# Altium schematic sheet IMU_Sensor.SchDoc
size A4; Author: İlker KESER; Revision: V1.0; SheetNumber: 9; SheetTotal: 9; Page: 9; Page Total: 9; Template: A4; Project Code: 02050838
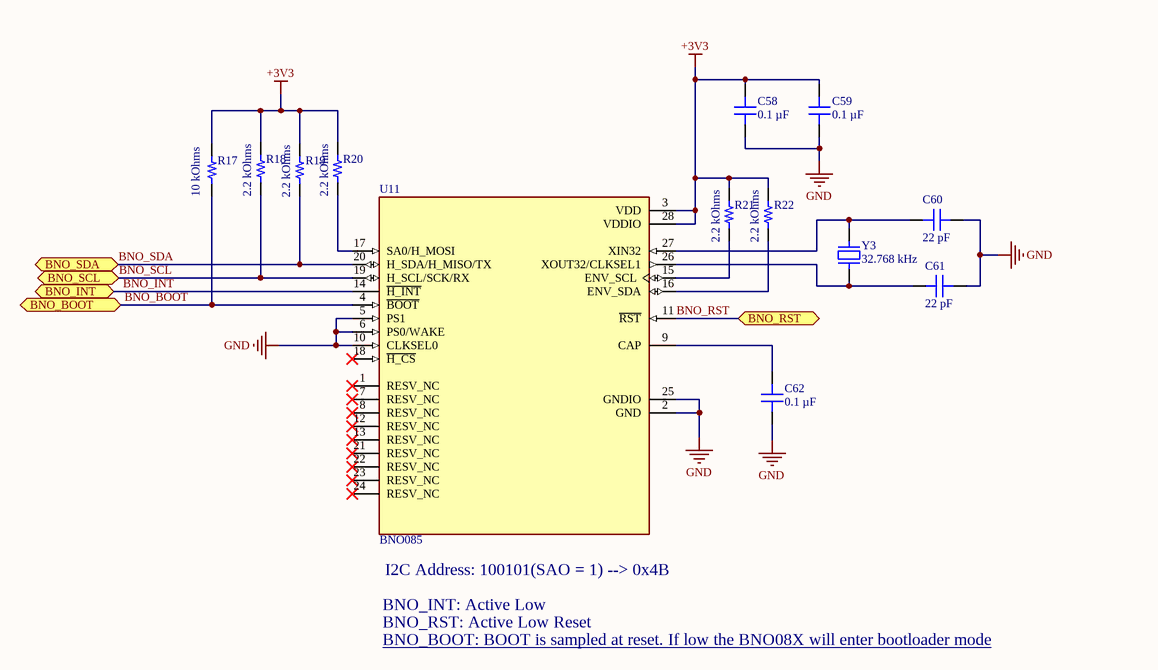
[diagram p0: IMU_Sensor.SchDoc]

## Parts
C58  0.1 µF  [CAP 0402_1005]
C59  0.1 µF  [CAP 0402_1005]
C60  22 pF  [CAP 0603_1608]
C61  22 pF  [CAP 0603_1608]
C62  0.1 µF  [CAP 0402_1005]
R17  10 kOhms  [RES 0402_1005]
R18  2.2 kOhms  [YAGEO RES 0402_1005]
R19  2.2 kOhms  [YAGEO RES 0402_1005]
R20  2.2 kOhms  [YAGEO RES 0402_1005]
R21  2.2 kOhms  [YAGEO RES 0402_1005]
R22  2.2 kOhms  [YAGEO RES 0402_1005]
U11  BNO085  [BNO085]
Y3  32.768 kHz  [ABRACON ABS06]

## Ports
BNO_BOOT (bidir, see Microcontroller[2A]), BNO_INT (bidir, see Microcontroller[2A]), BNO_RST (bidir, see Microcontroller[2A]), BNO_SCL (bidir, see Microcontroller[2A]), BNO_SDA (bidir, see Microcontroller[2B])

## Nets
+3V3: C58.2 C59.2 R17.2 R18.2 R19.2 R20.2 R21.2 R22.2 U11.3(VDD) U11.28(VDDIO)
GND: C58.1 C59.1 C60.2 C61.2 C62.1 U11.2(GND) U11.5(PS1) U11.6(PS0/WAKE) U11.10(CLKSEL0) U11.25(GNDIO)
BNO_BOOT: R17.1 U11.4(~{BOOT}) ; port BNO_BOOT
BNO_INT: U11.14(~{H_INT}) ; port BNO_INT
BNO_RST: U11.11(~{RST}) ; port BNO_RST
BNO_SCL: R18.1 U11.19(H_SCL/SCK/RX) ; port BNO_SCL
BNO_SDA: R19.1 U11.20(H_SDA/H_MISO/TX) ; port BNO_SDA
NetC60_1: C60.1 U11.27(XIN32) Y3.2
NetC61_1: C61.1 U11.26(XOUT32/CLKSEL1) Y3.1
NetC62_2: C62.2 U11.9(CAP)
NetR20_1: R20.1 U11.17(SA0/H_MOSI)
NetR21_1: R21.1 U11.15(ENV_SCL)
NetR22_1: R22.1 U11.16(ENV_SDA)

Not connected (* = marked no-connect by the designer): U11 1(RESV_NC)* 7(RESV_NC)* 8(RESV_NC)* 12(RESV_NC)* 13(RESV_NC)* 18(~{H_CS})* 21(RESV_NC)* 22(RESV_NC)* 23(RESV_NC)* 24(RESV_NC)*

## Notes on the sheet
- I2C Address: 100101(SAO = 1) --> 0x4B
- BNO_INT: Active Low
- BNO_RST: Active Low Reset
- BNO_BOOT: BOOT is sampled at reset. If low the BNO08X will enter bootloader mode <https://www.mouser.com.tr/datasheet/2/1480/BNO080_085_Datasheet-3196201.pdf>
- TITLE:
- DOCUMENT NAME:
- PROJECT CODE:
- TEMPLATE:
- REVISION:
- Sheet:
- of
- AUTHOR:

## Library data of the parts
C58 C59 C62 = C0402C104M9PAC7867: CAP CER 0.1UF 6.3V X5R 0402; manufacturer: KEMET; Tolerance: ±20%; Part Number: C0402C104M9PAC7867; Capacitance: 0.1 µF; Applications: Bypass, Decoupling; componentlink1description: Datasheet; componentlink1url: https://api.kemet.com/component-edge/download/datasheet/C0402C104M9PACTU.pdf; componentlink2description: DigiKey Link; componentlink2url: https://www.digikey.com/en/products/detail/kemet/C0402C104M9PAC7867/2196244; Device Package: 0402 (1005 Metric); lastupdated: 9.02.2024 20:04:15; Lifecycle Status: Active; Minimum Order: 1; Mounting Type: Surface Mount, MLCC; Operating Temperature: -55°C ~ 85°C; Package / Case: 0402 (1005 Metric); packaging: CutTape; partid: 33676; Part Status: Active; price: 0.01; series: SMD Comm X5R; Size / Dimension: 0.039" L x 0.020" W (1.00mm x 0.50mm); Supplier 1: DigiKey; Supplier Part Number 1: 399-C0402C104M9PAC7867CT-ND; Temperature Coefficient: X5R; Thickness (Max): 0.022" (0.55mm); value: 0.1 µF; Voltage - Rated: 6.3V
C60 C61 = C0603C220K8GAC7867: CAP CER 22PF 10V NP0 0603; manufacturer: KEMET; Temperature Coefficient: C0G, NP0; Tolerance: ±10%; Part Number: C0603C220K8GAC7867; Capacitance: 22 pF; Applications: General Purpose; componentlink1description: Datasheet; componentlink1url: https://api.kemet.com/component-edge/download/datasheet/C0603C220K8GACTU.pdf; componentlink2description: DigiKey Link; componentlink2url: https://www.digikey.com/en/products/detail/kemet/C0603C220K8GAC7867/2200197; Device Package: 0603 (1608 Metric); Features: Low ESL; lastupdated: 9.02.2024 20:09:59; Lifecycle Status: Active; Minimum Order: 1; Mounting Type: Surface Mount, MLCC; Operating Temperature: -55°C ~ 125°C; Package / Case: 0603 (1608 Metric); packaging: TapeAndReel; partid: 35708; Part Status: Active; price: 0.03; series: SMD Comm C0G; Size / Dimension: 0.063" L x 0.031" W (1.60mm x 0.80mm); Supplier 1: DigiKey; Supplier Part Number 1: 399-C0603C220K8GAC7867CT-ND; Thickness (Max): 0.034" (0.87mm); value: 22 pF; Voltage - Rated: 10V
R17 = TNPW040210K0BEED: RES 10K OHM 0.1% 1/16W 0402; Manufacturer: Vishay Dale; Power (Watts): 0.063W, 1/16W; Temperature Coefficient: ±25ppm/°C; Part Number: TNPW040210K0BEED; Value: 10 kOhms; ComponentLink1Description: Datasheet; ComponentLink1URL: http://www.vishay.com/docs/28758/tnpw_e3.pdf; ComponentLink2Description: DigiKey Link; ComponentLink2URL: https://www.digikey.com/en/products/detail/vishay-dale/TNPW040210K0BEED/1606424; Composition: Thin Film; Device Package: 0402 (1005 Metric); Features: Anti-Sulfur, Automotive AEC-Q200, Moisture Resistant; Height - Seated (Max): 0.016" (0.40mm); LastUpdated: 9.02.2024 20:29:49; Lifecycle Status: Active; Minimum Order: 1; Number of Terminations: 2; Operating Temperature: -55°C ~ 155°C; Package / Case: 0402 (1005 Metric); Packaging: TapeAndReel; PartId: 12339; Part Status: Active; Price: 0.10; Ratings: AEC-Q200; Resistance: 10 kOhms; Series: TNPW e3; Size / Dimension: 0.039" L x 0.020" W (1.00mm x 0.50mm); Supplier 1: DigiKey; Supplier Part Number 1: TNP10.0KDACT-ND; Supplier Device Package: 0402; Tolerance: ±0.1%
R18-R22 = RC0402FR-072K2L: RES 2.2K OHM 1% 1/16W 0402; Manufacturer: Yageo; Power (Watts): 0.063W, 1/16W; Temperature Coefficient: ±100ppm/°C; Part Number: RC0402FR-072K2L; Value: 2.2 kOhms; ComponentLink1Description: Datasheet; ComponentLink1URL: https://www.yageo.com/upload/media/product/productsearch/datasheet/rchip/PYu-RC_Group_51_RoHS_L_10.pdf; ComponentLink2Description: DigiKey Link; ComponentLink2URL: https://www.digikey.com/en/products/detail/yageo/RC0402FR-072K2L/726553; Composition: Thick Film; Device Package: 0402 (1005 Metric); Features: Moisture Resistant; Height - Seated (Max): 0.016" (0.40mm); LastUpdated: 25.07.2024 09:18:11; Lifecycle Status: Active; Minimum Order: 1; Number of Terminations: 2; Operating Temperature: -55°C ~ 155°C; Package / Case: 0402 (1005 Metric); Packaging: CutTape; PartId: 17607; Part Status: Active; Price: 0.01; Resistance: 2.2 kOhms; Series: RC_L; Size / Dimension: 0.039" L x 0.020" W (1.00mm x 0.50mm); Supplier 1: DigiKey; Supplier Part Number 1: 311-2.20KLRCT-ND; Supplier Device Package: 0402; Tolerance: ±1%
U11 = BNO085: Accelerometer, Gyroscope, Magnetometer, 9 Axis Sensor I2C, SPI, UART Output; Manufacturer: CEVA Technologies, Inc.; ComponentLink1Description: Datasheet; ComponentLink1URL: https://www.mouser.com.tr/datasheet/2/1480/BNO080_085_Datasheet-3196201.pdf; ComponentLink2Description: Digikey Link; ComponentLink2URL: https://www.digikey.com/en/products/detail/ceva-technologies-inc/BNO085/9445940; Supplier Device Package: 28-LGA (5.2x3.8); Package / Case: 28-TFLGA Module; Operating Temperature: -40°C ~ 85°C; Output Type: I2C, SPI, UART; Sensor Type: Accelerometer, Gyroscope, Magnetometer, 9 Axis
Y3 = ABS06-32.768KHZ-T: CRYSTAL 32.7680KHZ 12.5PF SMD; Manufacturer: Abracon LLC; ESR (Equivalent Series Resistance): 90 kOhms; Frequency Tolerance: ±20ppm; Operating Mode: Fundamental; Part Number: ABS06-32.768KHZ-T; ComponentLink1Description: Datasheet; ComponentLink1URL: https://abracon.com/Resonators/ABS06.pdf; ComponentLink2Description: DigiKey Link; ComponentLink2URL: https://www.digikey.com/en/products/detail/abracon-llc/ABS06-32-768KHZ-T/2089877; Frequency: 32.768 kHz; Height - Seated (Max): 0.024" (0.60mm); LastUpdated: 3.06.2024 20:02:03; Lifecycle Status: Active; Load Capacitance: 12.5pF; Minimum Order: 1; Mounting Type: Surface Mount; Operating Temperature: -40°C ~ 85°C; Package / Case: 2-SMD, No Lead; Packaging: TapeAndReel; PartId: 375; Part Status: Active; Price: 0.33; Series: ABS06; Size / Dimension: 0.079" L x 0.047" W (2.00mm x 1.20mm); Supplier 1: DigiKey; Supplier Part Number 1: 535-10104-1-ND; Type: kHz Crystal (Tuning Fork); Value: 32.768 kHz